# Altium project van_logic_board.PrjPcb
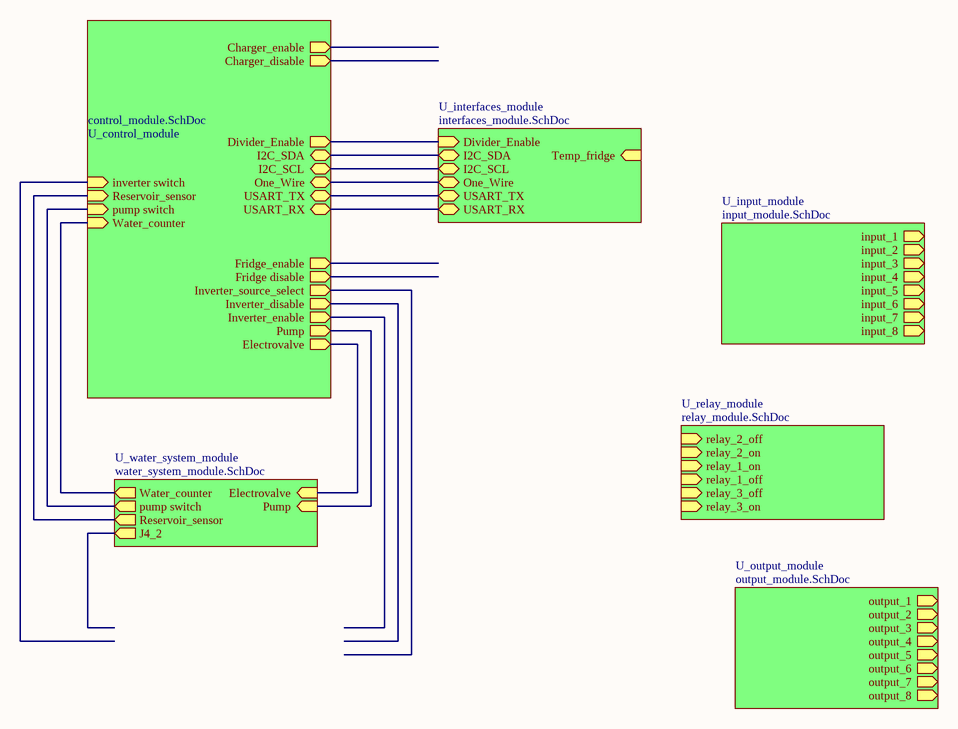
[diagram p0: main.SchDoc]
6 sheets, 114 parts. Net scope: hierarchical (ports join the sheet entries above them; power ports are global).
Board file: logic_board.PcbDoc
Sheets:
  main.SchDoc
    U_control_module = control_module.SchDoc
    U_interfaces_module = interfaces_module.SchDoc
    U_relay_module = relay_module.SchDoc
    U_input_module = input_module.SchDoc
    U_output_module = output_module.SchDoc

## Sheet main.SchDoc
size A4

### Sub-sheets
U_control_module = control_module.SchDoc: Inverter_source_select (out), Inverter_enable (out), Fridge_enable (out), Water_counter (in), Inverter_disable (out), Fridge disable (out), I2C_SDA (bidir), USART_RX (bidir), USART_TX (bidir), pump switch (in), inverter switch (in), I2C_SCL (bidir), One_Wire (bidir), Divider_Enable (out), Charger_enable (out), Charger_disable (out), Reservoir_sensor (in), Electrovalve (out), Pump (out)
U_input_module = input_module.SchDoc: input_1 (out), input_2 (out), input_3 (out), input_4 (out), input_5 (out), input_6 (out), input_7 (out), input_8 (out)
U_interfaces_module = interfaces_module.SchDoc: Temp_fridge (in), I2C_SDA (bidir), I2C_SCL (bidir), One_Wire (bidir), USART_TX (bidir), USART_RX (bidir), Divider_Enable (in)
U_output_module = output_module.SchDoc: output_1 (out), output_2 (out), output_3 (out), output_4 (out), output_5 (out), output_6 (out), output_7 (out), output_8 (out)
U_relay_module = relay_module.SchDoc: relay_2_off (in), relay_2_on (in), relay_1_on (in), relay_1_off (in), relay_3_off (in), relay_3_on (in)
U_water_system_module = water_system_module.SchDoc (file not in this document): Water_counter (out), pump switch (out), J4_2 (out), Reservoir_sensor (out), Electrovalve (in), Pump (in)

### Nets
NetBRD1_3: sheet U_control_module/I2C_SDA, sheet U_interfaces_module/I2C_SDA
NetBRD1_5: sheet U_control_module/I2C_SCL, sheet U_interfaces_module/I2C_SCL
NetBRD1_7: sheet U_control_module/One_Wire, sheet U_interfaces_module/One_Wire
NetBRD1_8: sheet U_control_module/USART_TX, sheet U_interfaces_module/USART_TX
NetBRD1_10: sheet U_control_module/USART_RX, sheet U_interfaces_module/USART_RX
(unnamed): sheet U_control_module/Water_counter, sheet U_water_system_module/Water_counter
(unnamed): sheet U_control_module/pump switch, sheet U_water_system_module/pump switch
(unnamed): sheet U_control_module/Divider_Enable, sheet U_interfaces_module/Divider_Enable
(unnamed): sheet U_control_module/Reservoir_sensor, sheet U_water_system_module/Reservoir_sensor
(unnamed): sheet U_control_module/Electrovalve, sheet U_water_system_module/Electrovalve
(unnamed): sheet U_control_module/Pump, sheet U_water_system_module/Pump

## Sheet control_module.SchDoc
size A4
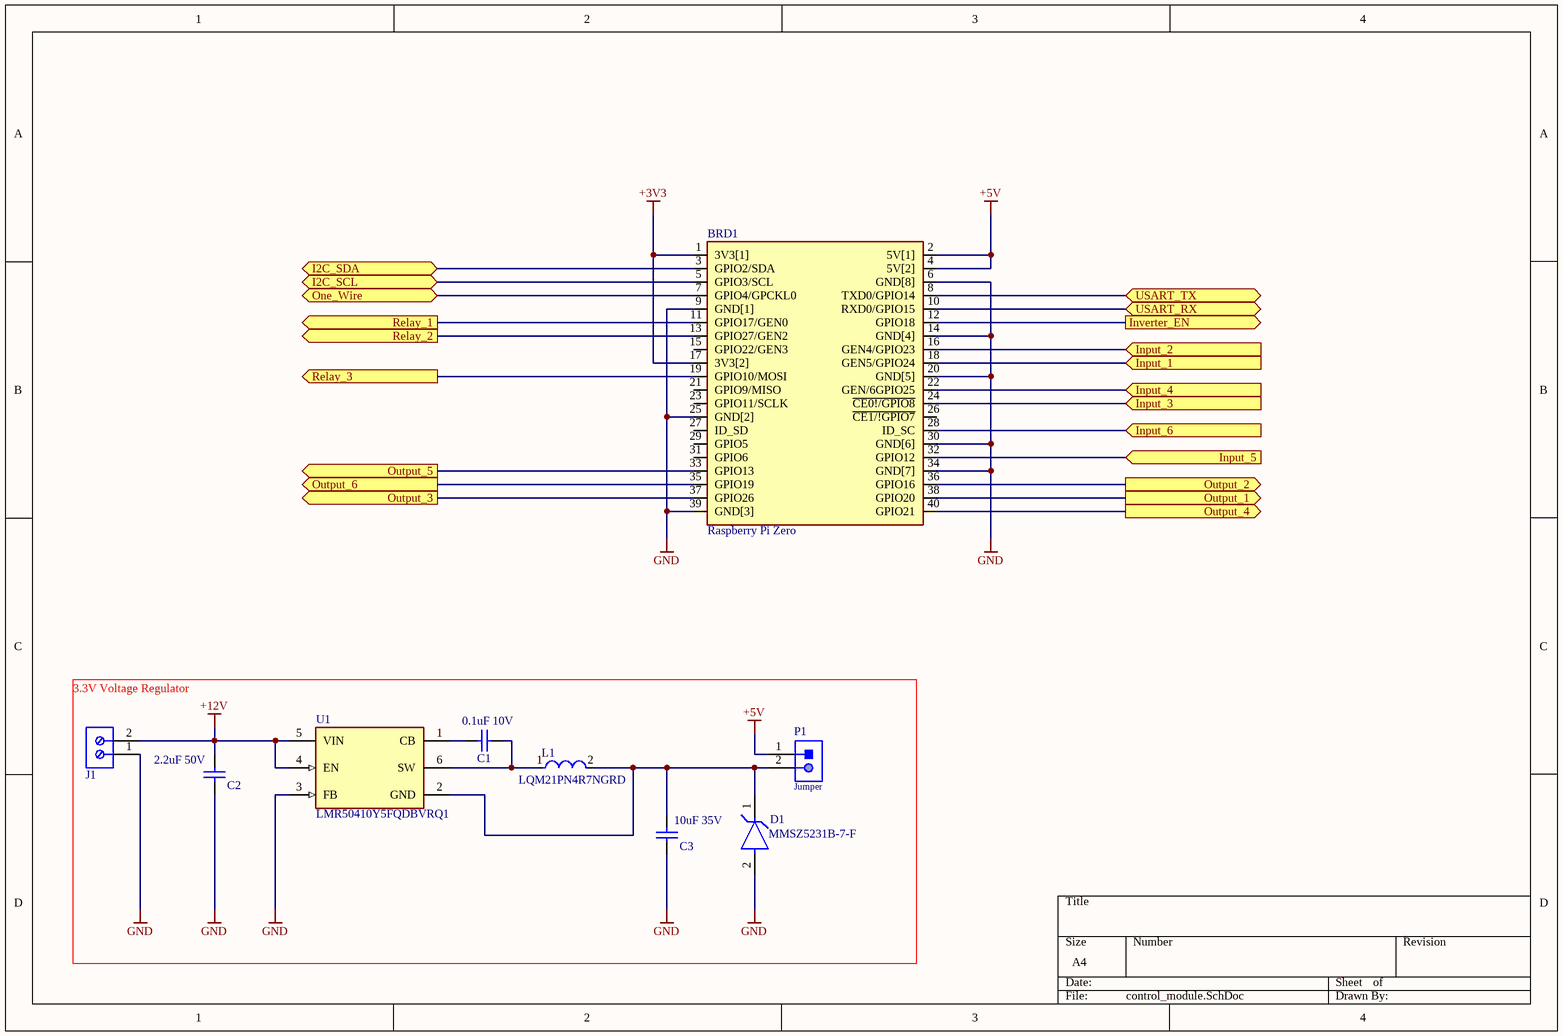
[diagram p1: control_module.SchDoc]

### Parts
(Parts that share a designator on the sheet are numbered #1, #2 ... from top to bottom, then left to right.)
BRD1  Raspberry Pi Zero  [RASPBERRY_PI_ZERO]
C1  0.1uF 10V  [CAPC2013X88X50ML20T25]
C2  2.2uF 50V  [CAPC2013X88X50ML20T25]
C3  10uF 35V  [CAPC2013X88X50ML20T25]
D1#1  MMSZ5231B-7-F  [FP-SOD123-MFG]
J1  282836-2  [TECO-282836-2_V]  (value not drawn)
L1  LQM21PN4R7NGRD  [FP-LQM21PH_G0-IPC_B]
P1  Jumper  [61300211121]
U1  LMR50410Y5FQDBVRQ1  [FP-DBV0006A-IPC_C]

### Ports
I2C_SCL (bidir), I2C_SDA (bidir), Input_1 (in), Input_2 (in), Input_3 (in), Input_4 (in), Input_5 (in), Input_6 (in), Inverter_EN (out), One_Wire (bidir), Output_1 (out), Output_2 (out), Output_3 (out), Output_4 (out), Output_5 (out), Output_6 (out), Relay_1 (out), Relay_2 (out), Relay_3 (out), USART_RX (bidir), USART_TX (bidir)

### Nets
+3V3: BRD1.1(3V3[1]) BRD1.17(3V3[2])
+5V: BRD1.2(5V[1]) BRD1.4(5V[2]) P1.1
+12V: C2.2 J1.2 U1.4(EN) U1.5(VIN)
GND: BRD1.6(GND[8]) BRD1.9(GND[1]) BRD1.14(GND[4]) BRD1.20(GND[5]) BRD1.25(GND[2]) BRD1.30(GND[6]) BRD1.34(GND[7]) BRD1.39(GND[3]) C2.1 C3.2 D1#1.2(A) J1.1 U1.3(FB)
NetBRD1_3: BRD1.3(GPIO2/SDA) ; port I2C_SDA
NetBRD1_5: BRD1.5(GPIO3/SCL) ; port I2C_SCL
NetBRD1_7: BRD1.7(GPIO4/GPCKL0) ; port One_Wire
NetBRD1_8: BRD1.8(TXD0/GPIO14) ; port USART_TX
NetBRD1_10: BRD1.10(RXD0/GPIO15) ; port USART_RX
NetBRD1_11: BRD1.11(GPIO17/GEN0) ; port Relay_1
NetBRD1_12: BRD1.12(GPIO18) ; port Inverter_EN
NetBRD1_13: BRD1.13(GPIO27/GEN2) ; port Relay_2
NetBRD1_16: BRD1.16(GEN4/GPIO23) ; port Input_2
NetBRD1_18: BRD1.18(GEN5/GPIO24) ; port Input_1
NetBRD1_19: BRD1.19(GPIO10/MOSI) ; port Relay_3
NetBRD1_22: BRD1.22(GEN/6GPIO25) ; port Input_4
NetBRD1_24: BRD1.24(~{CE0!/GPIO8}) ; port Input_3
NetBRD1_28: BRD1.28(ID_SC) ; port Input_6
NetBRD1_32: BRD1.32(GPIO12) ; port Input_5
NetBRD1_33: BRD1.33(GPIO13) ; port Output_5
NetBRD1_35: BRD1.35(GPIO19) ; port Output_6
NetBRD1_36: BRD1.36(GPIO16) ; port Output_2
NetBRD1_37: BRD1.37(GPIO26) ; port Output_3
NetBRD1_38: BRD1.38(GPIO20) ; port Output_1
NetBRD1_40: BRD1.40(GPIO21) ; port Output_4
NetC1_1: C1.1 L1.1 U1.6(SW)
NetC1_2: C1.2 U1.1(CB)
NetC3_1: C3.1 D1#1.1(C) L1.2 P1.2 U1.2(GND)

Not connected (* = marked no-connect by the designer): BRD1 15(GPIO22/GEN3) 21(GPIO9/MISO) 23(GPIO11/SCLK) 26(~{CE1/!GPIO7}) 27(ID_SD) 29(GPIO5) 31(GPIO6)

### Notes on the sheet
- 3.3V Voltage Regulator

### Library data of the parts
BRD1 = MCU_raspberryPi_zero: Raspberry Pi Zero with Header; MP: ADA3708; Availability: Unavailable; Package: None; MF: Raspberry Pi; Value: *; Price: None; SnapEDA_Link: https://www.snapeda.com/parts/ADA3708/Raspberry%20Pi/view-part/2770118/?ref=snap
C1-C3 = Cap_0805: Capacitor
D1#1 = CMP-12792-000005-1: DIODE ZENER 5.1V 500MW SOD123; Manufacturer: Diodes; Standoff Height: 0mm; Max Zener Voltage: 5.36V; Max Reverse Leakage Current: 5uA; Max Junction Temp: +150°C; Power Dissipation: 370mW; Zener Impedance: 17Ω; Temperature: -65°C to +150°C; RoHS: TRUE; ComponentLink2Description: Datasheet; Octopart: https://octopart.com/mmsz5231b-7-f-diodes+inc.-55400050; Height: 1.45mm; ComponentLink2URL: https://www.diodes.com/assets/Datasheets/ds18010.pdf; Footprint Url: https://www.diodes.com/assets/Package-Files/SOD123.pdf; Device Class L2: Diodes; Nom Zener Voltage: 5.1V; Temperature Range Low: -65°C; Mouser Description: Zener Diodes 5.1V 500mW; Manufacturer Part Number: MMSZ5231B-7-F; Digikey Description: DIODE ZENER 5.1V 500MW SOD123; Device Class L1: Discrete Semiconductors; Device Class L3: Zener Diodes; Lead Free: Yes; Category: Diode; Automotive: No; Package: SOD123; Temperature Range High: +150°C
J1 = CMP-1684-00017-1: Female Header, Pitch 5 mm, 1 x 2 Position, Height 10 mm, Tail Length 3.5 mm, Rohs, Bulk; Manufacturer: TE Connectivity; Wire Gauge: 16-30AWG; Product Training Modules: Wire-to-BoardEurostyleTerminalBlocks; Clamp Material - Plating: Brass-NickelPlated; Voltage: 300V; Mating Orientation: HorizontalwithBoard; Current: 13.5A; Pitch: 0.197"(5.00mm); Screw Thread: M3; 3D Model: 282836-2.pdf; Other Names: 5ULV-02B / A98076; Dynamic Catalog: BuchananSeries; Number of Levels: 1; Torque - Screw: 0.68Nm(6Lb-In); Featured Product: EurostyleTerminalBlockConnectors; Positions Per Level: 2; Wire Termination: Screw-RisingCageClamp; Datasheet URL: http://www.te.com.cn/commerce/DocumentDelivery/DDEController?Action=showdoc&DocId=Catalog+Section%7F1308389_EUROSTYLE_TERMINAL_BLOCKS%7F0607%7Fpdf%7FEnglish%7FENG_CS_1308389_EUROSTYLE_TERMINAL_BLOCKS_0607.pdf%7F282836-2; Color: Green; Family: TerminalBlocks-WiretoBoard; RoHS Information: 282836-2StatementofCompliance; Standard Package: 300; Contact Material - Plating: Brass-TinPlated; Manufacturer URL: http://www.te.com; Housing Material: Polyamide(PA66),Nylon6/6; Features: Interlocking(Side); Package Description: Female Header, Pitch 5 mm, 1 x 2 Position, Height 10 mm, Tail Length 3.5 mm; Mounting Type: ThroughHole; Package Reference: THD; Packaging: Bulk; Series: Buchanan; Category: Connectors,Interconnects; Screw Material - Plating: Brass-NickelPlated
L1 = CMP-06042-016903-1: Multilayer Type Inductor for Power Lines, 0805 (2012), 4.7μH, 30%, 0.288Ω, 0.8A; Test Frequency: 1MHz; Shielding: Shielded; DC Resistance (DCR): 288mR; Inductance: 4.7uH; Core Material: Ferrite; Current Rating: 800mA; Self Resonant Frequency: 30MHz; Min Operating Temperature: -55°C; Length: 0.079inch; Termination: SMD/SMT; Tolerance: 30%; Max Operating Temperature: 125°C; Case Code (Metric): 2012; Height - Seated (Max): 0.039inch; Series: LQM21PN_GR; Width: 1.25mm; Depth: 1.4mm; Package Quantity: 4000; Case/Package: 0805; Max DC Current: 800mA; Case Code (Imperial): 0805; Height: 0.9mm; Mount: Surface Mount; Military Standard: Not; DC Current: 800mA; Packaging: Tape and Reel; RoHS Compliant: Yes; Radiation Hardening: No; Lead Free: Lead Free
P1 = CMP-1712-00002-4: THT Vertical Pin Header WR-PHD, Pitch 2.54 mm, Single Row, 2 pins; Manufacturer: Wurth Elektronik; Rated Current: 3A; Gender: Male; Withstanding Voltage: 500VAC; Working Voltage: 250VAC; Pitch: 2.54mm; Contact Resistance: 20mOhm; Pin Number: 2; Mounting Technology: THT; Orientation: Vertical; Operating Temperature: -40to105degC; Packaging: Bag; Publisher: WurthElektronik; Datasheet URL: https://katalog.we-online.de/em/datasheet/6130xx11121.pdf; Manufacturer URL: http://www.we-online.de; Row Number: Single; Package Reference: 61300211121; Part Number: 61300211121
U1 = CMP-04918-000667-1: AUTOMOTIVE QUALIFIED SIMPLE SWIT

## Sheet interfaces_module.SchDoc
size A4
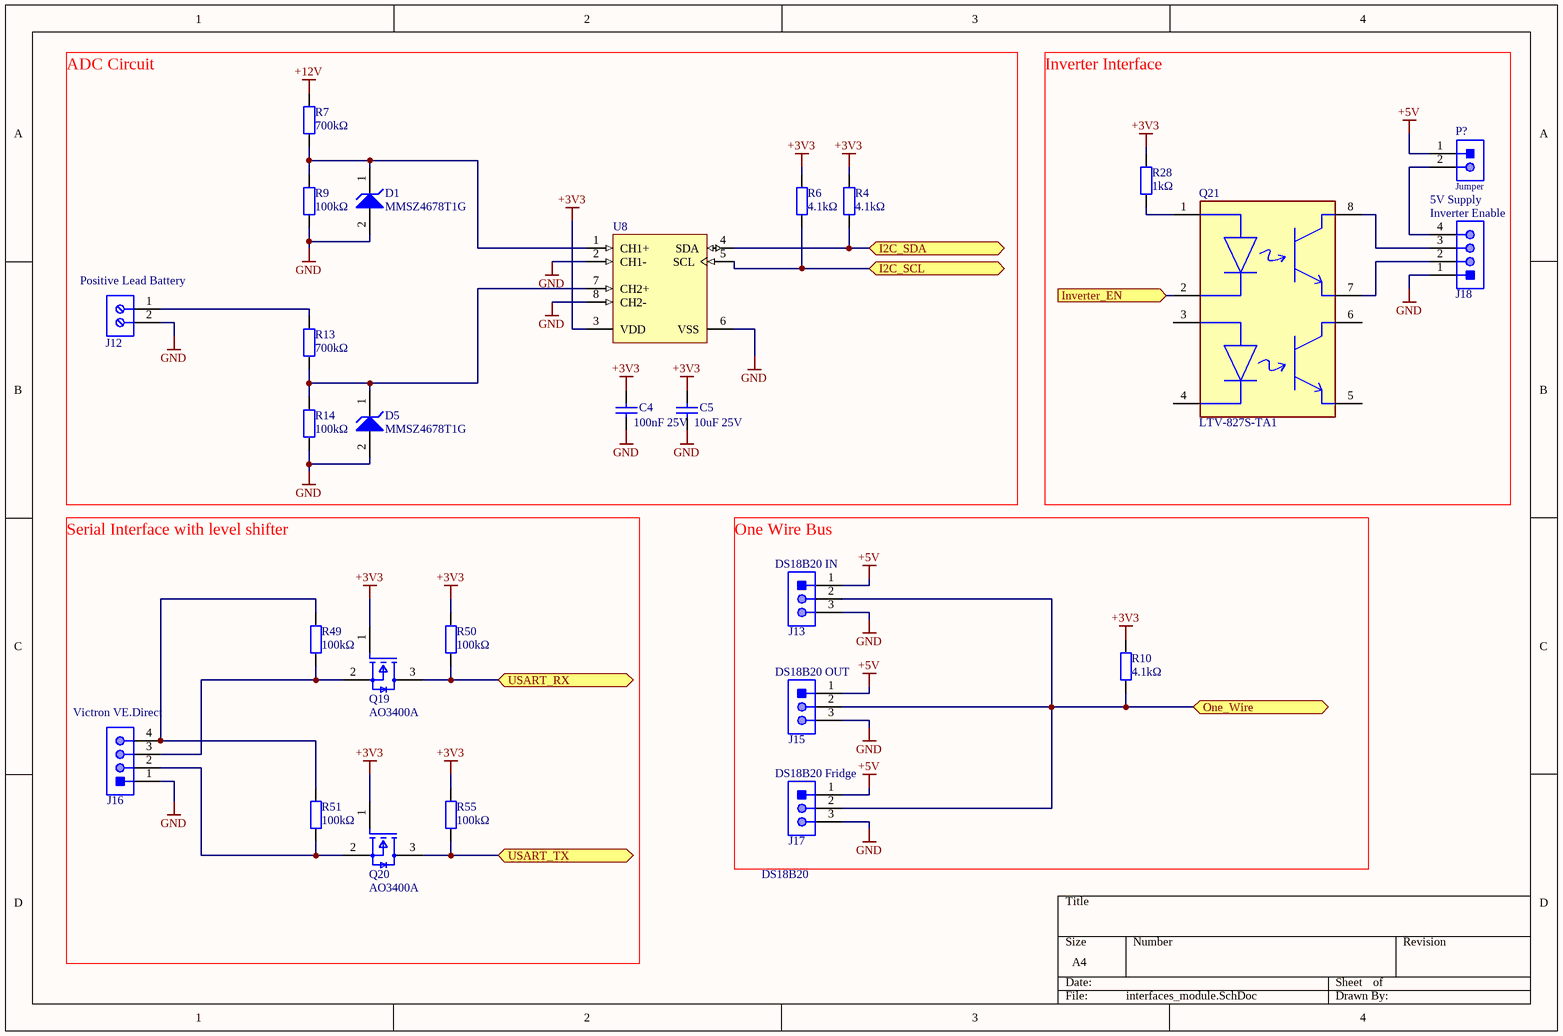
[diagram p2: interfaces_module.SchDoc]

### Parts
(Parts that share a designator on the sheet are numbered #1, #2 ... from top to bottom, then left to right.)
C4  100nF 25V  [CAPC2013X88X50ML20T25]
C5  10uF 25V  [CAPC2013X88X50ML20T25]
D1#2  MMSZ4678T1G  [ONSC-SOD-123-2-425-04_V]
D5#1  MMSZ4678T1G  [ONSC-SOD-123-2-425-04_V]
J12#1  282836-2  [TECO-282836-2_V]  (value not drawn)
J13#1  JST-S3B-PH-SM4-TB-3_V  [JST-S3B-PH-SM4-TB-3_V]  (value not drawn)
J15#1  JST-S3B-PH-SM4-TB-3_V  [JST-S3B-PH-SM4-TB-3_V]  (value not drawn)
J16#1  JST-S4B-PH-SM4-TB-3_V  [JST-S4B-PH-SM4-TB-3_V]  (value not drawn)
J17  JST-S3B-PH-SM4-TB-3_V  [JST-S3B-PH-SM4-TB-3_V]  (value not drawn)
J18  JST-S4B-PH-SM4-TB-3_V  [JST-S4B-PH-SM4-TB-3_V]  (value not drawn)
P?  Jumper  [61300211121]
Q19#1  AO3400A  [SOT-23]
Q20#1  AO3400A  [SOT-23]
Q21#1  LTV-827S-TA1  [FP-LTV-827S-TA1-MFG]
R4  4.1kΩ  [RESC2013X50X30ML20T20]
R6  4.1kΩ  [RESC2013X50X30ML20T20]
R7  700kΩ  [RESC2013X50X30ML20T20]
R9  100kΩ  [RESC2013X50X30ML20T20]
R10  4.1kΩ  [RESC2013X50X30ML20T20]
R13  700kΩ  [RESC2013X50X30ML20T20]
R14  100kΩ  [RESC2013X50X30ML20T20]
R28#1  1kΩ  [RESC2013X50X30ML20T20]
R49#1  100kΩ  [RESC2013X50X30ML20T20]
R50#1  100kΩ  [RESC2013X50X30ML20T20]
R51#1  100kΩ  [RESC2013X50X30ML20T20]
R55#1  100kΩ  [RESC2013X50X30ML20T20]
U8  (no value)  [SOIC-SN8_L]

### Ports
I2C_SCL (bidir), I2C_SDA (bidir), Inverter_EN (in), One_Wire (bidir), USART_RX (bidir), USART_TX (bidir)

### Nets
+3V3: C4.2 C5.2 Q19#1.1(G) Q20#1.1(G) R4.2 R6.2 R10.2 R28#1.1 R50#1.1 R55#1.1 U8.3(VDD)
+5V: J13#1.1 J15#1.1 J17.1 P?.1
+12V: R7.1
GND: C4.1 C5.1 D1#2.2(A) D5#1.2(A) J12#1.2 J13#1.3 J15#1.3 J16#1.1 J17.3 J18.1 R9.1 R14.1 U8.2(CH1-) U8.6(VSS) U8.8(CH2-)
NetBRD1_3: R4.1 U8.4(SDA) ; port I2C_SDA
NetBRD1_5: R6.1 U8.5(SCL) ; port I2C_SCL
NetBRD1_7: J13#1.2 J15#1.2 J17.2 R10.1 ; port One_Wire
NetBRD1_8: Q20#1.3(D) R55#1.2 ; port USART_TX
NetBRD1_10: Q19#1.3(D) R50#1.2 ; port USART_RX
NetD1#2_1: D1#2.1(K) R7.2 R9.2 U8.1(CH1+)
NetD5#1_1: D5#1.1(K) R13.2 R14.2 U8.7(CH2+)
NetJ12#1_1: J12#1.1 R13.1
NetJ16#1_2: J16#1.2 Q20#1.2(S) R51#1.2
NetJ16#1_3: J16#1.3 Q19#1.2(S) R49#1.2
NetJ16#1_4: J16#1.4 R49#1.1 R51#1.1
NetJ18_2: J18.2 Q21#1.7(E)
NetJ18_3: J18.3 Q21#1.8(C)
NetJ18_4: J18.4 P?.2
NetQ21#1_1: Q21#1.1(1_Anode) R28#1.2
NetQ21#1_2: Q21#1.2(1_Cathode) ; port Inverter_EN

Not connected (* = marked no-connect by the designer): Q21#1 3(2_Anode) 4(2_Cathode) 5(E) 6(C)

### Notes on the sheet
- 5V Supply
- (near J18) Inverter Enable
- (near J12#1) Positive Lead Battery
- ADC Circuit
- Inverter Interface
- (near J13#1) DS18B20 IN
- (near J16#1) Victron VE.Direct
- (near J15#1) DS18B20 OUT
- (near J17) DS18B20 Fridge
- One Wire Bus
- (near J17) DS18B20
- Serial Interface with level shifter

### Library data of the parts
C4 C5 = Cap_0805: Capacitor
D1#2 D5#1 = CMP-1060-00511-1: Zener Voltage Regulator, 500 mW, 2-Pin SOD-123, Pb-Free, Tape and Reel; Manufacturer: On Semiconductor; P Max (W): 0.5; VZ Typ (V): 1.8; PackageDescription: 2-Pin SOD, Body 1.6 x 2.69 mm; ComponentLink3Description: Package Specification; PackageReference: SOD-123-2-425-04; RoHS: Pb-Free; PackageVersion: Rev. G, 10/2009; Packing: Tape and Reel; ComponentLink1URL: http://www.onsemi.com/; ComponentLink2Description: Datasheet; ComponentLink3URL: http://www.onsemi.com/pub_link/Collateral/425-04.PDF; ComponentLink2URL: http://www.onsemi.com/pub_link/Collateral/MMSZ4678T1-D.PDF; DatasheetVersion: Rev. 9; ComponentLink1Description: Manufacturer URL; Mounting Technology: Surface Mount; PartNumber: MMSZ4678T1G
J12#1 = CMP-1684-00017-1: as J1 on sheet control_module; Datasheet URL: http://www.te.com.cn/commerce/DocumentDelivery/DDEController?Action=showdoc&DocId=Catalog+Section%7F1308389_EUROSTYLE_TERMINAL_BLOCKS%7F0607%7Fpdf%7FEnglish%7FENG_CS_1308389_EUROSTYLE_TERMINAL_BLOCKS_0607.pdf%7F282836-2; Color: Green; Family: TerminalBlocks-WiretoBoard; RoHS Information: 282836-2StatementofCompliance; Standard Package: 300; Contact Material - Plating: Brass-TinPlated; Manufacturer URL: http://www.te.com; Housing Material: Polyamide(PA66),Nylon6/6; Features: Interlocking(Side); Package Description: Female Header, Pitch 5 mm, 1 x 2 Position, Height 10 mm, Tail Length 3.5 mm; Mounting Type: ThroughHole; Package Reference: THD; Packaging: Bulk; Series: Buchanan; Category: Connectors,Interconnects; Screw Material - Plating: Brass-NickelPlated
J13#1 J15#1 J17 = CONNECTOR_JST-S3B-PH-SM4
J16#1 J18 = CONNECTOR_JST-S4B-PH-SM4
P? = CMP-1712-00002-4: as P1 on sheet control_module; Mounting Technology: THT; Orientation: Vertical; Operating Temperature: -40to105degC; Packaging: Bag; Publisher: WurthElektronik; Datasheet URL: https://katalog.we-online.de/em/datasheet/6130xx11121.pdf; Manufacturer URL: http://www.we-online.de; Row Number: Single; Package Reference: 61300211121; Part Number: 61300211121
Q19#1 Q20#1 = MOSFET_AO3400A: MOSFET N-CH 30V 5.7A SOT23; Input Capacitance: 630pF; Number of Elements: 1; Rds On Max: 26.5mR; Max Power Dissipation: 1.4W; Gate to Source Voltage (Vgs): 12V; Min Operating Temperature: -55°C; Lead Free: Lead Free; Number of Pins: 3; Drain to Source Voltage (Vdss): 30V; Case/Package: SOT-23; Mount: Surface Mount; Continuous Drain Current (ID): 5.7A; Radiation Hardening: No; Packaging: Tape and Reel; Max Operating Temperature: 150°C; Power Dissipation: 1.4W
Q21#1 = CMP-22018-000005-1: OPTOISOLATOR 5KV 2CH TRANS 8-SMD; Number of Channels: 2; Forward Current: 50mA; Reverse Breakdown Voltage: 6V; Current Transfer Ratio: 600%; Collector Emitter Saturation Voltage: 200mV; Collector Emitter Voltage (VCEO): 35V; Max Power Dissipation: 200mW; Rise Time: 18000ns; Forward Voltage: 1.4V; Number of Elements: 2; Min Operating Temperature: -30°C; Number of Circuits: 2; Max Collector Current: 50mA; Packaging: Tape and Reel; Max Input Current: 50mA; Case/Package: SMD/SMT; Radiation Hardening: No; Package Quantity: 1000; Max Output Voltage: 35V; Output Current per Channel: 50mA; Fall Time: 18000ns; Mount: Surface Mount; Isolation Voltage: 5kV; Power Dissipation: 200mW; Lead Free: Lead Free; Max Operating Temperature: 110°C; Output Voltage: 35V; Number of Pins: 8
R4 R6 R7 R9 R10 R13 R14 R28#1 R49#1 R50#1 R51#1 R55#1 = Res_0805: Resistor
U8 = CMP-0188-01151-1: 16-Bit, Multi-Channel Delta-Sigma Analog-to-Digital Converter with I2C Interface and On-Board Reference, 8-Pin SOIC 150mil, Extended Temperature; ComponentLink2Description: Datasheet; ComponentLink3Description: Package Specification; PackageVersion: revBB, Aug-2009; Code_JEDEC: MS-012; Code_IPC: SOIC127P600-8; PackageDescription: 8-Lead Plastic Small Outline (SN) - Narrow, 3.90mm Body [SOIC]; ComponentLink1Description: Manufacturer URL; ComponentLink2URL: http://ww1.microchip.com/downloads/en/DeviceDoc/22226a.pdf; ComponentLink1URL: http://www.microchip.com/; DatasheetVersion: revA, Dec-2009; ComponentLink3URL: http://www.microchip.com/stellent/groups/techpub_sg/documents/packagingspec/en012702.pdf; PackageReference: SOIC-SN8

## Sheet relay_module.SchDoc
size A4
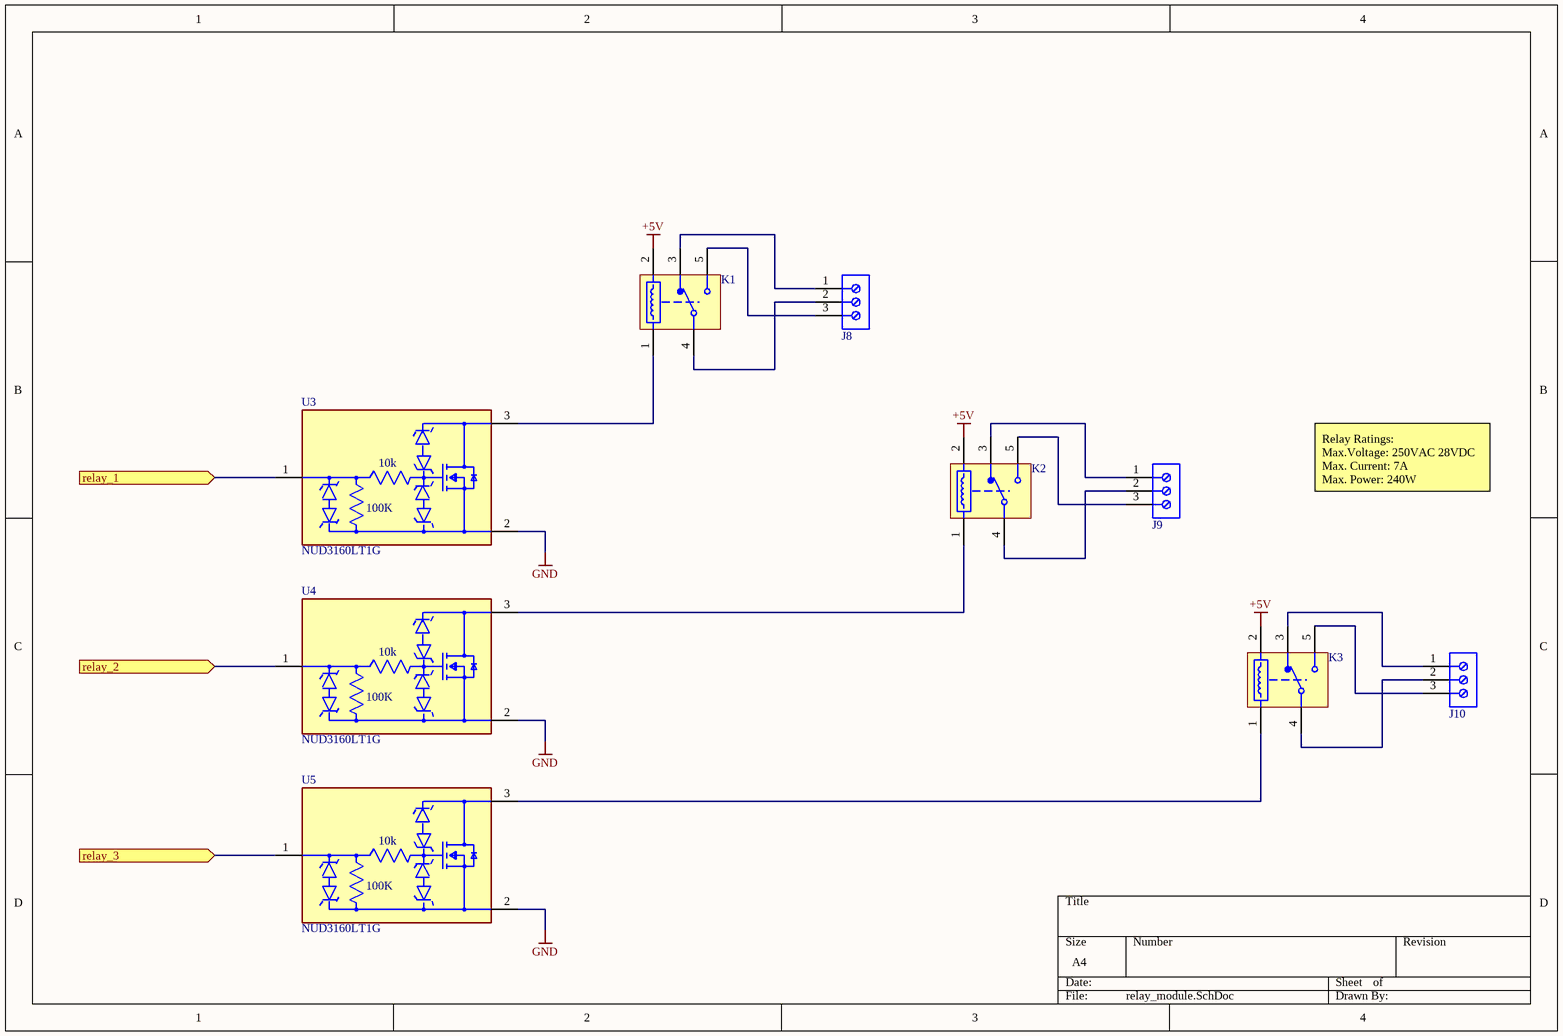
[diagram p3: relay_module.SchDoc]

### Parts
J8  282836-3  [TE_282836-3]  (value not drawn)
J9  282836-3  [TE_282836-3]  (value not drawn)
J10  282836-3  [TE_282836-3]  (value not drawn)
K1  RELAY_SRD-05VDC-SL-C  [SRD-05-VDC-SL-C]  (value not drawn)
K2  RELAY_SRD-05VDC-SL-C  [SRD-05-VDC-SL-C]  (value not drawn)
K3  RELAY_SRD-05VDC-SL-C  [SRD-05-VDC-SL-C]  (value not drawn)
U3  NUD3160LT1G  [FP-318-08-MFG]
U4  NUD3160LT1G  [FP-318-08-MFG]
U5  NUD3160LT1G  [FP-318-08-MFG]

### Ports
relay_1 (in), relay_2 (in), relay_3 (in)

### Nets
+5V: K1.2 K2.2 K3.2
GND: U3.2(Source) U4.2(Source) U5.2(Source)
NetJ8_1: J8.1 K1.3(NC)
NetJ8_2: J8.2 K1.4(COM)
NetJ8_3: J8.3 K1.5(NO)
NetJ9_1: J9.1 K2.3(NC)
NetJ9_2: J9.2 K2.4(COM)
NetJ9_3: J9.3 K2.5(NO)
NetJ10_1: J10.1 K3.3(NC)
NetJ10_2: J10.2 K3.4(COM)
NetJ10_3: J10.3 K3.5(NO)
NetK1_1: K1.1 U3.3(Drain)
NetK2_1: K2.1 U4.3(Drain)
NetK3_1: K3.1 U5.3(Drain)
NetU3_1: U3.1(Gate) ; port relay_1
NetU4_1: U4.1(Gate) ; port relay_2
NetU5_1: U5.1(Gate) ; port relay_3

### Notes on the sheet
- Relay Ratings:
  Max.Voltage: 250VAC 28VDC
  Max. Current: 7A
  Max. Power: 240W
- (in symbol CMP-07123-000002-1) 10k; 100K

### Library data of the parts
J8-J10 = 282836-3: Connector, Terminal Block; Wire Receptacle; 3 Pos.; 16-30 AWG; 0.197 in. CL; Sid; Manufacturer: TE Connectivity; Plating: Brass; Number of Levels: 1; Number of Positions Per Level: 3; Current: 13.5A; Voltage: 300V; Closed End: No (Without); Interlock: Yes (With); Voltage Rating (AC): 250V; Pitch: 5mm; Wire Gauge (Max): 30AWG; Wire Gauge (Min): 16AWG; Tail Length: 3.5mm; Thread Size: M3; Approvals: UL; Supplier 1: Mouser; Manufacturer Part Number: 282836-3; RoHS: Yes; Category: Terminal Blocks; Stock 1: 394; Pricing 1: 1=0.96000, 10=0.57500, 50=0.57500, 100=0.48300, 600=0.45700, 1000=0.40600, 2600=0.36800, 4800=0.33000, 10000=0.33000, 11200=0.31700, 25600=0.31100 (USD); Mount: Through Hole,Board; Housing Color: Green; Contact Plating: Tin; Contact Material: Brass; Color: Green; Housing Material: Polyamide; Insulation Material: Nylon; Number of Rows: 1; Termination: Screw; Package Quantity: 200; Packaging: Bulk; Number of Positions: 3; Orientation: Straight; Series: Buchanan; Connector Type: Receptacle; Number of Contacts: 3; Screw Flange: No (Without); Screwless Terminal Block: No (Without); Side Stackable: Yes (With); Current Rating: 13.5A; Max Current Rating: 13.5A; Voltage Rating: 300V; Number of Circuits: 3; Max Supply Voltage (AC): 300V; Number of Poles: 3; Max Voltage Rating (AC): 300V; RMS Current (Irms): 13.5A; Working Voltage: 250V; Length: 15mm; Width: 10mm; Depth: 8.2mm; Wire/Cable Gauge: 16AWG; Radiation Hardening: No; Flammability Rating: UL94 V-0; RoHS Compliant: Yes; ELV: Compliant; REACH SVHC: Unknown; Lead Free: Lead Free; ComponentLink1URL: https://datasheet.ciiva.com/15169/getdatasheetpartid-155856-15169554.pdf?src-supplier=Verical; ComponentLink1Description: https://datasheet.ciiva.com/15169/getdatasheetpartid-155856-15169554.pdf?src-supplier=Verical; ComponentLink2URL: https://datasheet.ciiva.com/16305/eng-cs-1308389-eurostyle-terminal-blocks-0607-16305242.pdf?src-supplier=Future+Electronics; ComponentLink2Description: https://datasheet.ciiva.com/16305/eng-cs-1308389-eurostyle-terminal-blocks-0607-16305242.pdf?src-supplier=Future+Electronics; ComponentLink3URL: https://datasheet.ciiva.com/19460/750661-19460522.pdf?src-supplier=Jameco; ComponentLink3Description: https://datasheet.ciiva.com/19460/750661-19460522.pdf?src-supplier=Jameco; ComponentLink4URL: https://datasheet.ciiva.com/11757/0900766b8002dc8a-11757406.pdf?src-supplier=RSComponents; ComponentLink4Description: https://datasheet.ciiva.com/11757/0900766b8002dc8a-11757406.pdf?src-supplier=RSComponents; ComponentLink5URL: https://datasheet.ciiva.com/823/eng-cd-282836-h10-823445.pdf?src-supplier=Digi-Key; ComponentLink5Description: https://datasheet.ciiva.com/823/eng-cd-282836-h10-823445.pdf?src-supplier=Digi-Key; ComponentLink6URL: https://datasheet.ciiva.com/30106/eng-cs-1308389-eurostyle-terminal-blocks-0607-30106198.pdf?src-supplier=Onlinecomponents.com; ComponentLink6Description: https://datasheet.ciiva.com/30106/eng-cs-1308389-eurostyle-terminal-blocks-0607-30106198.pdf?src-supplier=Onlinecomponents.com; ComponentLink7URL: https://datasheet.ciiva.com/14606/70086276-14606907.pdf?src-supplier=Allied+Electronics; ComponentLink7Description: https://datasheet.ciiva.com/14606/70086276-14606907.pdf?src-supplier=Allied+Electronics; ComponentLink8URL: https://datasheet.ciiva.com/16649/eng-cs-1308389-eurostyle-terminal-blocks-0607-16649389.pdf?src-supplier=Avnet+Europe; ComponentLink8Description: https://datasheet.ciiva.com/16649/eng-cs-1308389-eurostyle-terminal-blocks-0607-16649389.pdf?src-supplier=Avnet+Europe; ComponentLink9URL: https://datasheet.ciiva.com/3141/eng-cs-1308389-eurostyle-terminal-blocks-0607-3141119.pdf?src-supplier=Avnet; ComponentLink9Description: https://datasheet.ciiva.com/3141/eng-cs-1308389-eurostyle-terminal-blocks-0607-3141119.pdf?src-supplier=Avnet; Supplier Part Number 1: 571-2828363
K1-K3 = RELAY_SRD-05VDC-SL-C: 5VDC SPDT Relay; Switching power: 240W; Max. AC current: 3A; Max. DC current: 7A; ca: 7A
U3-U5 = CMP-07123-000002-1: IC INDCT LOAD DRVR INDUST SOT23; Manufacturer: ON Semiconductor; Max Power Dissipation: 225mW; Fall Time: 622ns; Max Supply Voltage: 60V; Propagation Delay: 1160ns; Output Current: 150mA; Output Voltage: 48V; Standoff Height: 0.01mm; Number Of Outputs: 1; Max Junction Temp: +150°C; Rise Time: 600ns; Temperature Range Low: -40°C; Mouser Description: MOSFET 61V Industrial Load Driver; Ambient Temperature Range High: +125°C; Octopart: https://octopart.com/nud3160lt1g-on+semiconductor-470723; Package: 318-08; Automotive: No; Temperature: -40°C to +150°C; RoHS: TRUE; Lead Free: Yes; Height: 1.11mm; Device Class L3: Gate Drivers; Ambient Temperature Range Low: -40°C; Device Class L2: Power Management ICs; Digikey Description: IC INDCT LOAD DRVR INDUST SOT23; Category: IC; Device Class L1: Integrated Circuits (ICs); Manufacturer Part Number: NUD3160LT1G; Footprint Url: https://www.onsemi.com/pub/Collateral/318-08.PDF; Number Of Drivers: 1; ComponentLink2Description: Datasheet; Temperature Range High: +150°C; ComponentLink2URL: https://www.onsemi.com/pub/Collateral/NUD3160-D.PDF

## Sheet input_module.SchDoc
size A4
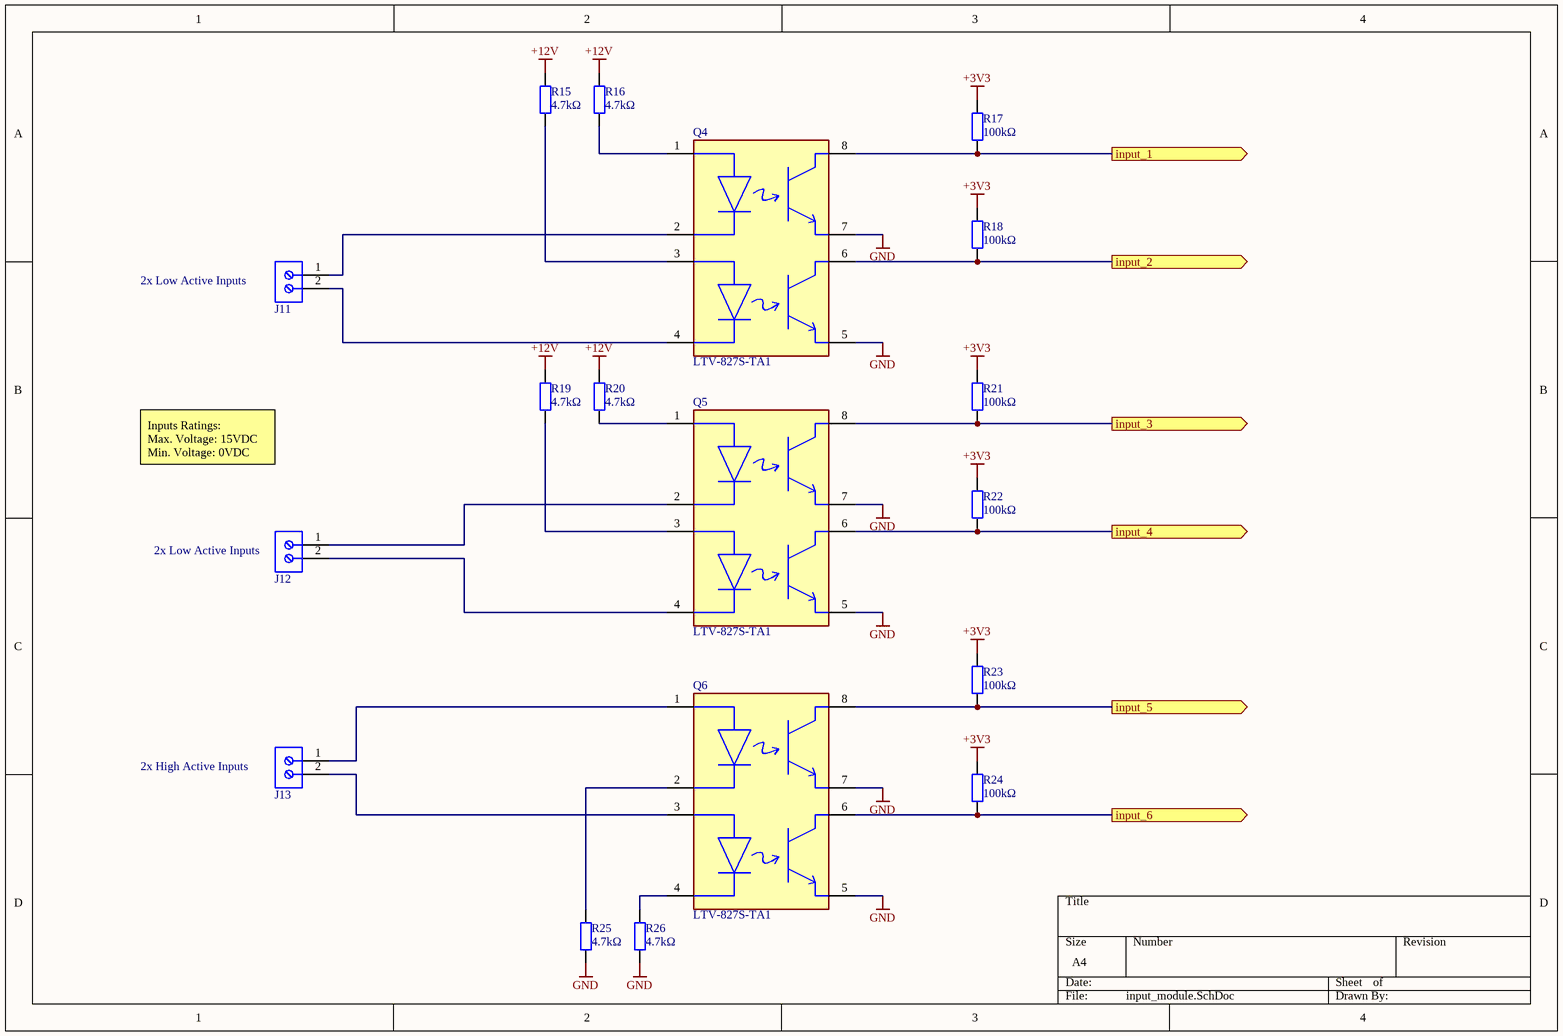
[diagram p4: input_module.SchDoc]

### Parts
(Parts that share a designator on the sheet are numbered #1, #2 ... from top to bottom, then left to right.)
J11  282836-2  [TECO-282836-2_V]  (value not drawn)
J12#2  282836-2  [TECO-282836-2_V]  (value not drawn)
J13#2  282836-2  [TECO-282836-2_V]  (value not drawn)
Q4  LTV-827S-TA1  [FP-LTV-827S-TA1-MFG]
Q5  LTV-827S-TA1  [FP-LTV-827S-TA1-MFG]
Q6  LTV-827S-TA1  [FP-LTV-827S-TA1-MFG]
R15  4.7kΩ  [RESC2013X50X30ML20T20]
R16  4.7kΩ  [RESC2013X50X30ML20T20]
R17  100kΩ  [RESC2013X50X30ML20T20]
R18  100kΩ  [RESC2013X50X30ML20T20]
R19  4.7kΩ  [RESC2013X50X30ML20T20]
R20  4.7kΩ  [RESC2013X50X30ML20T20]
R21  100kΩ  [RESC2013X50X30ML20T20]
R22  100kΩ  [RESC2013X50X30ML20T20]
R23  100kΩ  [RESC2013X50X30ML20T20]
R24  100kΩ  [RESC2013X50X30ML20T20]
R25  4.7kΩ  [RESC2013X50X30ML20T20]
R26  4.7kΩ  [RESC2013X50X30ML20T20]

### Ports
input_1 (out), input_2 (out), input_3 (out), input_4 (out), input_5 (out), input_6 (out)

### Nets
+3V3: R17.1 R18.1 R21.1 R22.1 R23.1 R24.1
+12V: R15.1 R16.1 R19.1 R20.1
GND: Q4.5(E) Q4.7(E) Q5.5(E) Q5.7(E) Q6.5(E) Q6.7(E) R25.2 R26.2
NetJ11_1: J11.1 Q4.2(1_Cathode)
NetJ11_2: J11.2 Q4.4(2_Cathode)
NetJ12#2_1: J12#2.1 Q5.2(1_Cathode)
NetJ12#2_2: J12#2.2 Q5.4(2_Cathode)
NetJ13#2_1: J13#2.1 Q6.1(1_Anode)
NetJ13#2_2: J13#2.2 Q6.3(2_Anode)
NetQ4_1: Q4.1(1_Anode) R16.2
NetQ4_3: Q4.3(2_Anode) R15.2
NetQ4_6: Q4.6(C) R18.2 ; port input_2
NetQ4_8: Q4.8(C) R17.2 ; port input_1
NetQ5_1: Q5.1(1_Anode) R20.2
NetQ5_3: Q5.3(2_Anode) R19.2
NetQ5_6: Q5.6(C) R22.2 ; port input_4
NetQ5_8: Q5.8(C) R21.2 ; port input_3
NetQ6_2: Q6.2(1_Cathode) R25.1
NetQ6_4: Q6.4(2_Cathode) R26.1
NetQ6_6: Q6.6(C) R24.2 ; port input_6
NetQ6_8: Q6.8(C) R23.2 ; port input_5

### Notes on the sheet
- (near J11) 2x Low Active Inputs
- Inputs Ratings:
  Max. Voltage: 15VDC
  Min. Voltage: 0VDC
- (near J12#2) 2x Low Active Inputs
- (near J13#2) 2x High Active Inputs

### Library data of the parts
J11 J12#2 J13#2 = CMP-1684-00017-1: as J1 on sheet control_module; Datasheet URL: http://www.te.com.cn/commerce/DocumentDelivery/DDEController?Action=showdoc&DocId=Catalog+Section%7F1308389_EUROSTYLE_TERMINAL_BLOCKS%7F0607%7Fpdf%7FEnglish%7FENG_CS_1308389_EUROSTYLE_TERMINAL_BLOCKS_0607.pdf%7F282836-2; Color: Green; Family: TerminalBlocks-WiretoBoard; RoHS Information: 282836-2StatementofCompliance; Standard Package: 300; Contact Material - Plating: Brass-TinPlated; Manufacturer URL: http://www.te.com; Housing Material: Polyamide(PA66),Nylon6/6; Features: Interlocking(Side); Package Description: Female Header, Pitch 5 mm, 1 x 2 Position, Height 10 mm, Tail Length 3.5 mm; Mounting Type: ThroughHole; Package Reference: THD; Packaging: Bulk; Series: Buchanan; Category: Connectors,Interconnects; Screw Material - Plating: Brass-NickelPlated
Q4-Q6 = CMP-22018-000005-1: as Q21#1 on sheet interfaces_module; Number of Elements: 2; Min Operating Temperature: -30°C; Number of Circuits: 2; Max Collector Current: 50mA; Packaging: Tape and Reel; Max Input Current: 50mA; Case/Package: SMD/SMT; Radiation Hardening: No; Package Quantity: 1000; Max Output Voltage: 35V; Output Current per Channel: 50mA; Fall Time: 18000ns; Mount: Surface Mount; Isolation Voltage: 5kV; Power Dissipation: 200mW; Lead Free: Lead Free; Max Operating Temperature: 110°C; Output Voltage: 35V; Number of Pins: 8
R15-R26 = Res_0805: Resistor

## Sheet output_module.SchDoc
size A4
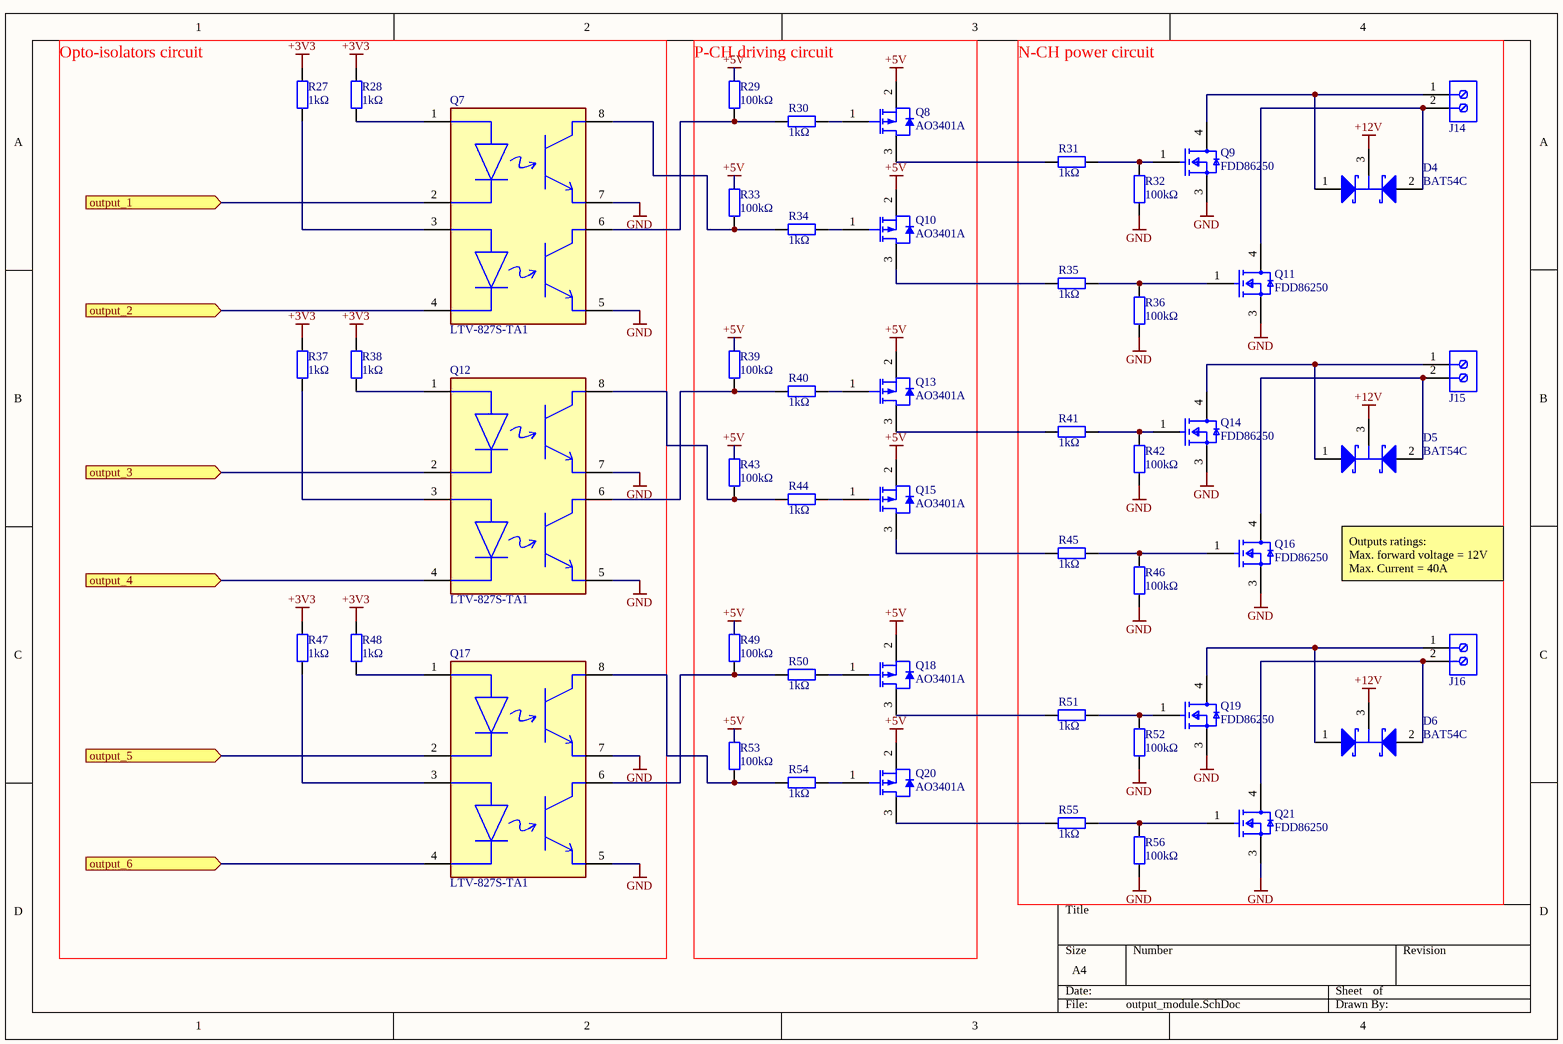
[diagram p5: output_module.SchDoc]

### Parts
(Parts that share a designator on the sheet are numbered #1, #2 ... from top to bottom, then left to right.)
D4  BAT54C  [SOT-23]
D5#2  BAT54C  [SOT-23]
D6  BAT54C  [SOT-23]
J14  282836-2  [TECO-282836-2_V]  (value not drawn)
J15#2  282836-2  [TECO-282836-2_V]  (value not drawn)
J16#2  282836-2  [TECO-282836-2_V]  (value not drawn)
Q7  LTV-827S-TA1  [FP-LTV-827S-TA1-MFG]
Q8  AO3401A  [AO-SOT-23-3L_V]
Q9  FDD86250  [FP-369AS-MFG]
Q10  AO3401A  [AO-SOT-23-3L_V]
Q11  FDD86250  [FP-369AS-MFG]
Q12  LTV-827S-TA1  [FP-LTV-827S-TA1-MFG]
Q13  AO3401A  [AO-SOT-23-3L_V]
Q14  FDD86250  [FP-369AS-MFG]
Q15  AO3401A  [AO-SOT-23-3L_V]
Q16  FDD86250  [FP-369AS-MFG]
Q17  LTV-827S-TA1  [FP-LTV-827S-TA1-MFG]
Q18  AO3401A  [AO-SOT-23-3L_V]
Q19#2  FDD86250  [FP-369AS-MFG]
Q20#2  AO3401A  [AO-SOT-23-3L_V]
Q21#2  FDD86250  [FP-369AS-MFG]
R27  1kΩ  [RESC2013X50X30ML20T20]
R28#2  1kΩ  [RESC2013X50X30ML20T20]
R29  100kΩ  [RESC2013X50X30ML20T20]
R30  1kΩ  [RESC2013X50X30ML20T20]
R31  1kΩ  [RESC2013X50X30ML20T20]
R32  100kΩ  [RESC2013X50X30ML20T20]
R33  100kΩ  [RESC2013X50X30ML20T20]
R34  1kΩ  [RESC2013X50X30ML20T20]
R35  1kΩ  [RESC2013X50X30ML20T20]
R36  100kΩ  [RESC2013X50X30ML20T20]
R37  1kΩ  [RESC2013X50X30ML20T20]
R38  1kΩ  [RESC2013X50X30ML20T20]
R39  100kΩ  [RESC2013X50X30ML20T20]
R40  1kΩ  [RESC2013X50X30ML20T20]
R41  1kΩ  [RESC2013X50X30ML20T20]
R42  100kΩ  [RESC2013X50X30ML20T20]
R43  100kΩ  [RESC2013X50X30ML20T20]
R44  1kΩ  [RESC2013X50X30ML20T20]
R45  1kΩ  [RESC2013X50X30ML20T20]
R46  100kΩ  [RESC2013X50X30ML20T20]
R47  1kΩ  [RESC2013X50X30ML20T20]
R48  1kΩ  [RESC2013X50X30ML20T20]
R49#2  100kΩ  [RESC2013X50X30ML20T20]
R50#2  1kΩ  [RESC2013X50X30ML20T20]
R51#2  1kΩ  [RESC2013X50X30ML20T20]
R52  100kΩ  [RESC2013X50X30ML20T20]
R53  100kΩ  [RESC2013X50X30ML20T20]
R54  1kΩ  [RESC2013X50X30ML20T20]
R55#2  1kΩ  [RESC2013X50X30ML20T20]
R56  100kΩ  [RESC2013X50X30ML20T20]

### Ports
output_1 (in), output_2 (in), output_3 (in), output_4 (in), output_5 (in), output_6 (in)

### Nets
+3V3: R27.1 R28#2.1 R37.1 R38.1 R47.1 R48.1
+5V: Q8.2(SOURCE) Q10.2(SOURCE) Q13.2(SOURCE) Q15.2(SOURCE) Q18.2(SOURCE) Q20#2.2(SOURCE) R29.1 R33.1 R39.1 R43.1 R49#2.1 R53.1
+12V: D4.3(K) D5#2.3(K) D6.3(K)
GND: Q7.5(E) Q7.7(E) Q9.3(S) Q11.3(S) Q12.5(E) Q12.7(E) Q14.3(S) Q16.3(S) Q17.5(E) Q17.7(E) Q19#2.3(S) Q21#2.3(S) R32.1 R36.1 R42.1 R46.1 R52.1 R56.1
NetD4_1: D4.1(A) J14.1 Q9.4(D)
NetD4_2: D4.2(A) J14.2 Q11.4(D)
NetD5#2_1: D5#2.1(A) J15#2.1 Q14.4(D)
NetD5#2_2: D5#2.2(A) J15#2.2 Q16.4(D)
NetD6_1: D6.1(A) J16#2.1 Q19#2.4(D)
NetD6_2: D6.2(A) J16#2.2 Q21#2.4(D)
NetQ7_1: Q7.1(1_Anode) R28#2.2
NetQ7_2: Q7.2(1_Cathode) ; port output_1
NetQ7_3: Q7.3(2_Anode) R27.2
NetQ7_4: Q7.4(2_Cathode) ; port output_2
NetQ7_6: Q7.6(C) R29.2 R30.1
NetQ7_8: Q7.8(C) R33.2 R34.1
NetQ8_1: Q8.1(GATE) R30.2
NetQ8_3: Q8.3(DRAIN) R31.1
NetQ9_1: Q9.1(G) R31.2 R32.2
NetQ10_1: Q10.1(GATE) R34.2
NetQ10_3: Q10.3(DRAIN) R35.1
NetQ11_1: Q11.1(G) R35.2 R36.2
NetQ12_1: Q12.1(1_Anode) R38.2
NetQ12_2: Q12.2(1_Cathode) ; port output_3
NetQ12_3: Q12.3(2_Anode) R37.2
NetQ12_4: Q12.4(2_Cathode) ; port output_4
NetQ12_6: Q12.6(C) R39.2 R40.1
NetQ12_8: Q12.8(C) R43.2 R44.1
NetQ13_1: Q13.1(GATE) R40.2
NetQ13_3: Q13.3(DRAIN) R41.1
NetQ14_1: Q14.1(G) R41.2 R42.2
NetQ15_1: Q15.1(GATE) R44.2
NetQ15_3: Q15.3(DRAIN) R45.1
NetQ16_1: Q16.1(G) R45.2 R46.2
NetQ17_1: Q17.1(1_Anode) R48.2
NetQ17_2: Q17.2(1_Cathode) ; port output_5
NetQ17_3: Q17.3(2_Anode) R47.2
NetQ17_4: Q17.4(2_Cathode) ; port output_6
NetQ17_6: Q17.6(C) R49#2.2 R50#2.1
NetQ17_8: Q17.8(C) R53.2 R54.1
NetQ18_1: Q18.1(GATE) R50#2.2
NetQ18_3: Q18.3(DRAIN) R51#2.1
NetQ19#2_1: Q19#2.1(G) R51#2.2 R52.2
NetQ20#2_1: Q20#2.1(GATE) R54.2
NetQ20#2_3: Q20#2.3(DRAIN) R55#2.1
NetQ21#2_1: Q21#2.1(G) R55#2.2 R56.2

### Notes on the sheet
- Outputs ratings:
  Max. forward voltage = 12V
  Max. Current = 40A
- N-CH power circuit
- Opto-isolators circuit
- P-CH driving circuit

### Library data of the parts
D4 D5#2 D6 = DIODE_BAT54C: Schottky Barrier Diode, 30 V, 3-Pin SOT23, RoHS, Tape and Reel; Manufacturer: NXP Semiconductors; Forward Surge Current Ifsm Max: 600mA; Pin Configuration: 1A1,2A2,3comK; Package Version: Feb-16; Forward Voltage VF Max: 800mV; SMD Marking: L43/*W1; Reverse Recovery Time trr Typ: 5ns; Forward Current If(AV): 200mA; Reel Quantity: 3000; SVHC: NoSVHC(19-Dec-2012); No. of Pins: 3; Junction Temperature Tj Max: 125degC; Common Connection: Cathode; Repetitive Reverse Voltage Vrrm Max: 30V; Operating Temperature Max: 150degC; Operating Temperature Range: -65degCto+150degC; Diode Case Style: SOT-23; Termination Type: SMD; Package Description: 3-Pin Small Outline Transistor, Body 1.3 x 2.9 mm, Pitch 0.95 mm; Package / Case: SOT-23; Diode Type: Schottky; Manufacturer URL: http://www.nxp.com/; Tape Width: 8mm; Package Reference: SOT23-3; Datasheet URL: https://datasheet.ciiva.com/33723/1668625-33723936.pdf; Datasheet Version: Rev. 5 , 10/2012; Operating Temperature Min: -65degC; Current Ifsm: 600mA; Reverse Recovery Time trr Max: 5ns; Package URL: http://www.nxp.com/documents/outline_drawing/SOT23.pdf; Forward Voltage: 800mV
J14 J15#2 J16#2 = CMP-1684-00017-1: as J1 on sheet control_module; Datasheet URL: http://www.te.com.cn/commerce/DocumentDelivery/DDEController?Action=showdoc&DocId=Catalog+Section%7F1308389_EUROSTYLE_TERMINAL_BLOCKS%7F0607%7Fpdf%7FEnglish%7FENG_CS_1308389_EUROSTYLE_TERMINAL_BLOCKS_0607.pdf%7F282836-2; Color: Green; Family: TerminalBlocks-WiretoBoard; RoHS Information: 282836-2StatementofCompliance; Standard Package: 300; Contact Material - Plating: Brass-TinPlated; Manufacturer URL: http://www.te.com; Housing Material: Polyamide(PA66),Nylon6/6; Features: Interlocking(Side); Package Description: Female Header, Pitch 5 mm, 1 x 2 Position, Height 10 mm, Tail Length 3.5 mm; Mounting Type: ThroughHole; Package Reference: THD; Packaging: Bulk; Series: Buchanan; Category: Connectors,Interconnects; Screw Material - Plating: Brass-NickelPlated
Q7 Q12 Q17 = CMP-22018-000005-1: as Q21#1 on sheet interfaces_module; Number of Elements: 2; Min Operating Temperature: -30°C; Number of Circuits: 2; Max Collector Current: 50mA; Packaging: Tape and Reel; Max Input Current: 50mA; Case/Package: SMD/SMT; Radiation Hardening: No; Package Quantity: 1000; Max Output Voltage: 35V; Output Current per Channel: 50mA; Fall Time: 18000ns; Mount: Surface Mount; Isolation Voltage: 5kV; Power Dissipation: 200mW; Lead Free: Lead Free; Max Operating Temperature: 110°C; Output Voltage: 35V; Number of Pins: 8
Q8 Q10 Q13 Q15 Q18 Q20#2 = CMP-2000-05778-1: P-Channel MOSFET, 30 V, 4 A, -55 to 150 degC, 3-Pin SOT-23-3L, RoHS, Tape and Reel; Manufacturer: Alpha and Omega; Output Power (Max): NotRequiredW; Power Dissipation: 1.4W; Rad Hardened: No; Drain Efficiency: NotRequired%; Drain-Source On-Volt: 30V; Noise Figure: NotRequireddB; Frequency (Max): NotRequiredMHz; Number of  Elements: 1; Gate-Source Voltage (Max): ?12V; Drain Current (Max): 4A; Channel Mode: Enhancement; Drain-Source On-Res: 0.044ohm; Type: PowerMOSFET; Polarity: P; Package URL: http://www.aosmd.com/res/packaging_information/SOT-23-3L.pdf; Datasheet URL: http://www.aosmd.com/res/data_sheets/AO3401A.pdf; Package Type: SOT-23; Package Description: 3-Pin Small Outline Transistor, Body 2.95 x 1.6 mm, Pitch 0.95 mm; Mounting: SurfaceMount; Manufacturer URL: http://www.aosmd.com/; Continuous Drain Current: 4A; Package Reference: SOT-23-3L; Mounting Technology: SurfaceMount; Operating Temperature Classification: Military; Power Gain: NotRequireddB; Datasheet Version: Rev. 3, 03/2011; Operating Temp Range: -55Cto150C; Pin Count: 3
Q9 Q11 Q14 Q16 Q19#2 Q21#2 = CMP-07173-000037-1: MOSFET N-CH 150V 8A DPAK; Manufacturer: ON Semiconductor; Threshold Vgs Max: 4V; Power Dissipation: 3.1W; Gate Charge At Vgs: 23nC @ 10V; Turn On Delay Time: 11.2ns; Reverse Recovery Charge: 104nC; Max Forward Diode Voltage: 1.3V; Pulse Drain Current: 164A; Max Junction Temp: +150°C; Depletion Mode: False; Rthja Max: 40°C/W; Input Capacitace At Vds: 1585pF @ 75V; Number Of N Channels: 1; Gate To Source Voltage: 20V; Reverse Recovery Time: 71ns; Threshold Vgs Min: 2V; Typ Forward Diode Voltage: 0.78V; Transconductance: 28S; Drain To Source Resistance: 18.4mΩ; Turn Off Delay Time: 20ns; Footprint Url: https://www.onsemi.com/pub/Collateral/369AS.PDF; Automotive: No; Continuous Drain Current: 8A; Digikey Description: MOSFET N-CH 150V 8A DPAK; RoHS: TRUE; Device Class L1: Discrete Semiconductors; ComponentLink2URL: https://www.onsemi.com/pub/Collateral/FDD86250-D.pdf; Lead Free: Yes; Drain To Source Breakdown Voltage: 150V; Octopart: https://octopart.com/fdd86250-on+semiconductor-84325855; Temperature Range Low: -55°C; Device Class L3: MOSFETs; Manufacturer Part Number: FDD86250; Package: 369AS; Temperature Range High: +150°C; Category: Trans; Mouser Description: Shielded Gate PowerTrench® MOSFET, N-Channel, 150 V, 51 A, 22 mO; ComponentLink2Description: Datasheet; Temperature: -55°C to +150°C; Drain To Source Voltage: 150V; Number Of Channels: 1; Height: 2.517mm; Device Class L2: Transistors
R27 R28#2 R29-R48 R49#2 R50#2 R51#2 R52-R54 R55#2 R56 = Res_0805: Resistor

## Nets that join several sheets
+3V3: control_module (BRD1.1 BRD1.17), interfaces_module (11 pins), input_module (6 pins), output_module (6 pins)
+5V: control_module (BRD1.2 BRD1.4 P1.1), interfaces_module (J13#1.1 J15#1.1 J17.1 P?.1), relay_module (K1.2 K2.2 K3.2), output_module (12 pins)
+12V: control_module (C2.2 J1.2 U1.4 U1.5), interfaces_module (R7.1), input_module (R15.1 R16.1 R19.1 R20.1), output_module (D4.3 D5#2.3 D6.3)
GND: control_module (13 pins), interfaces_module (15 pins), relay_module (U3.2 U4.2 U5.2), input_module (8 pins), output_module (18 pins)
NetBRD1_3: control_module (BRD1.3), interfaces_module (R4.1 U8.4)
NetBRD1_5: control_module (BRD1.5), interfaces_module (R6.1 U8.5)
NetBRD1_7: control_module (BRD1.7), interfaces_module (J13#1.2 J15#1.2 J17.2 R10.1)
NetBRD1_8: control_module (BRD1.8), interfaces_module (Q20#1.3 R55#1.2)
NetBRD1_10: control_module (BRD1.10), interfaces_module (Q19#1.3 R50#1.2)